# EasyEDA Pro project ne555.eprj

# Schematic NE555BOOT1
Create Date: 2024-05-28; Page Name: P1; Project Name: ne555; Schematic Name: NE555BOOT1; Update Date: 2024-06-29; Company: 嘉立创EDA; Page Size: A4; Version: V1.0
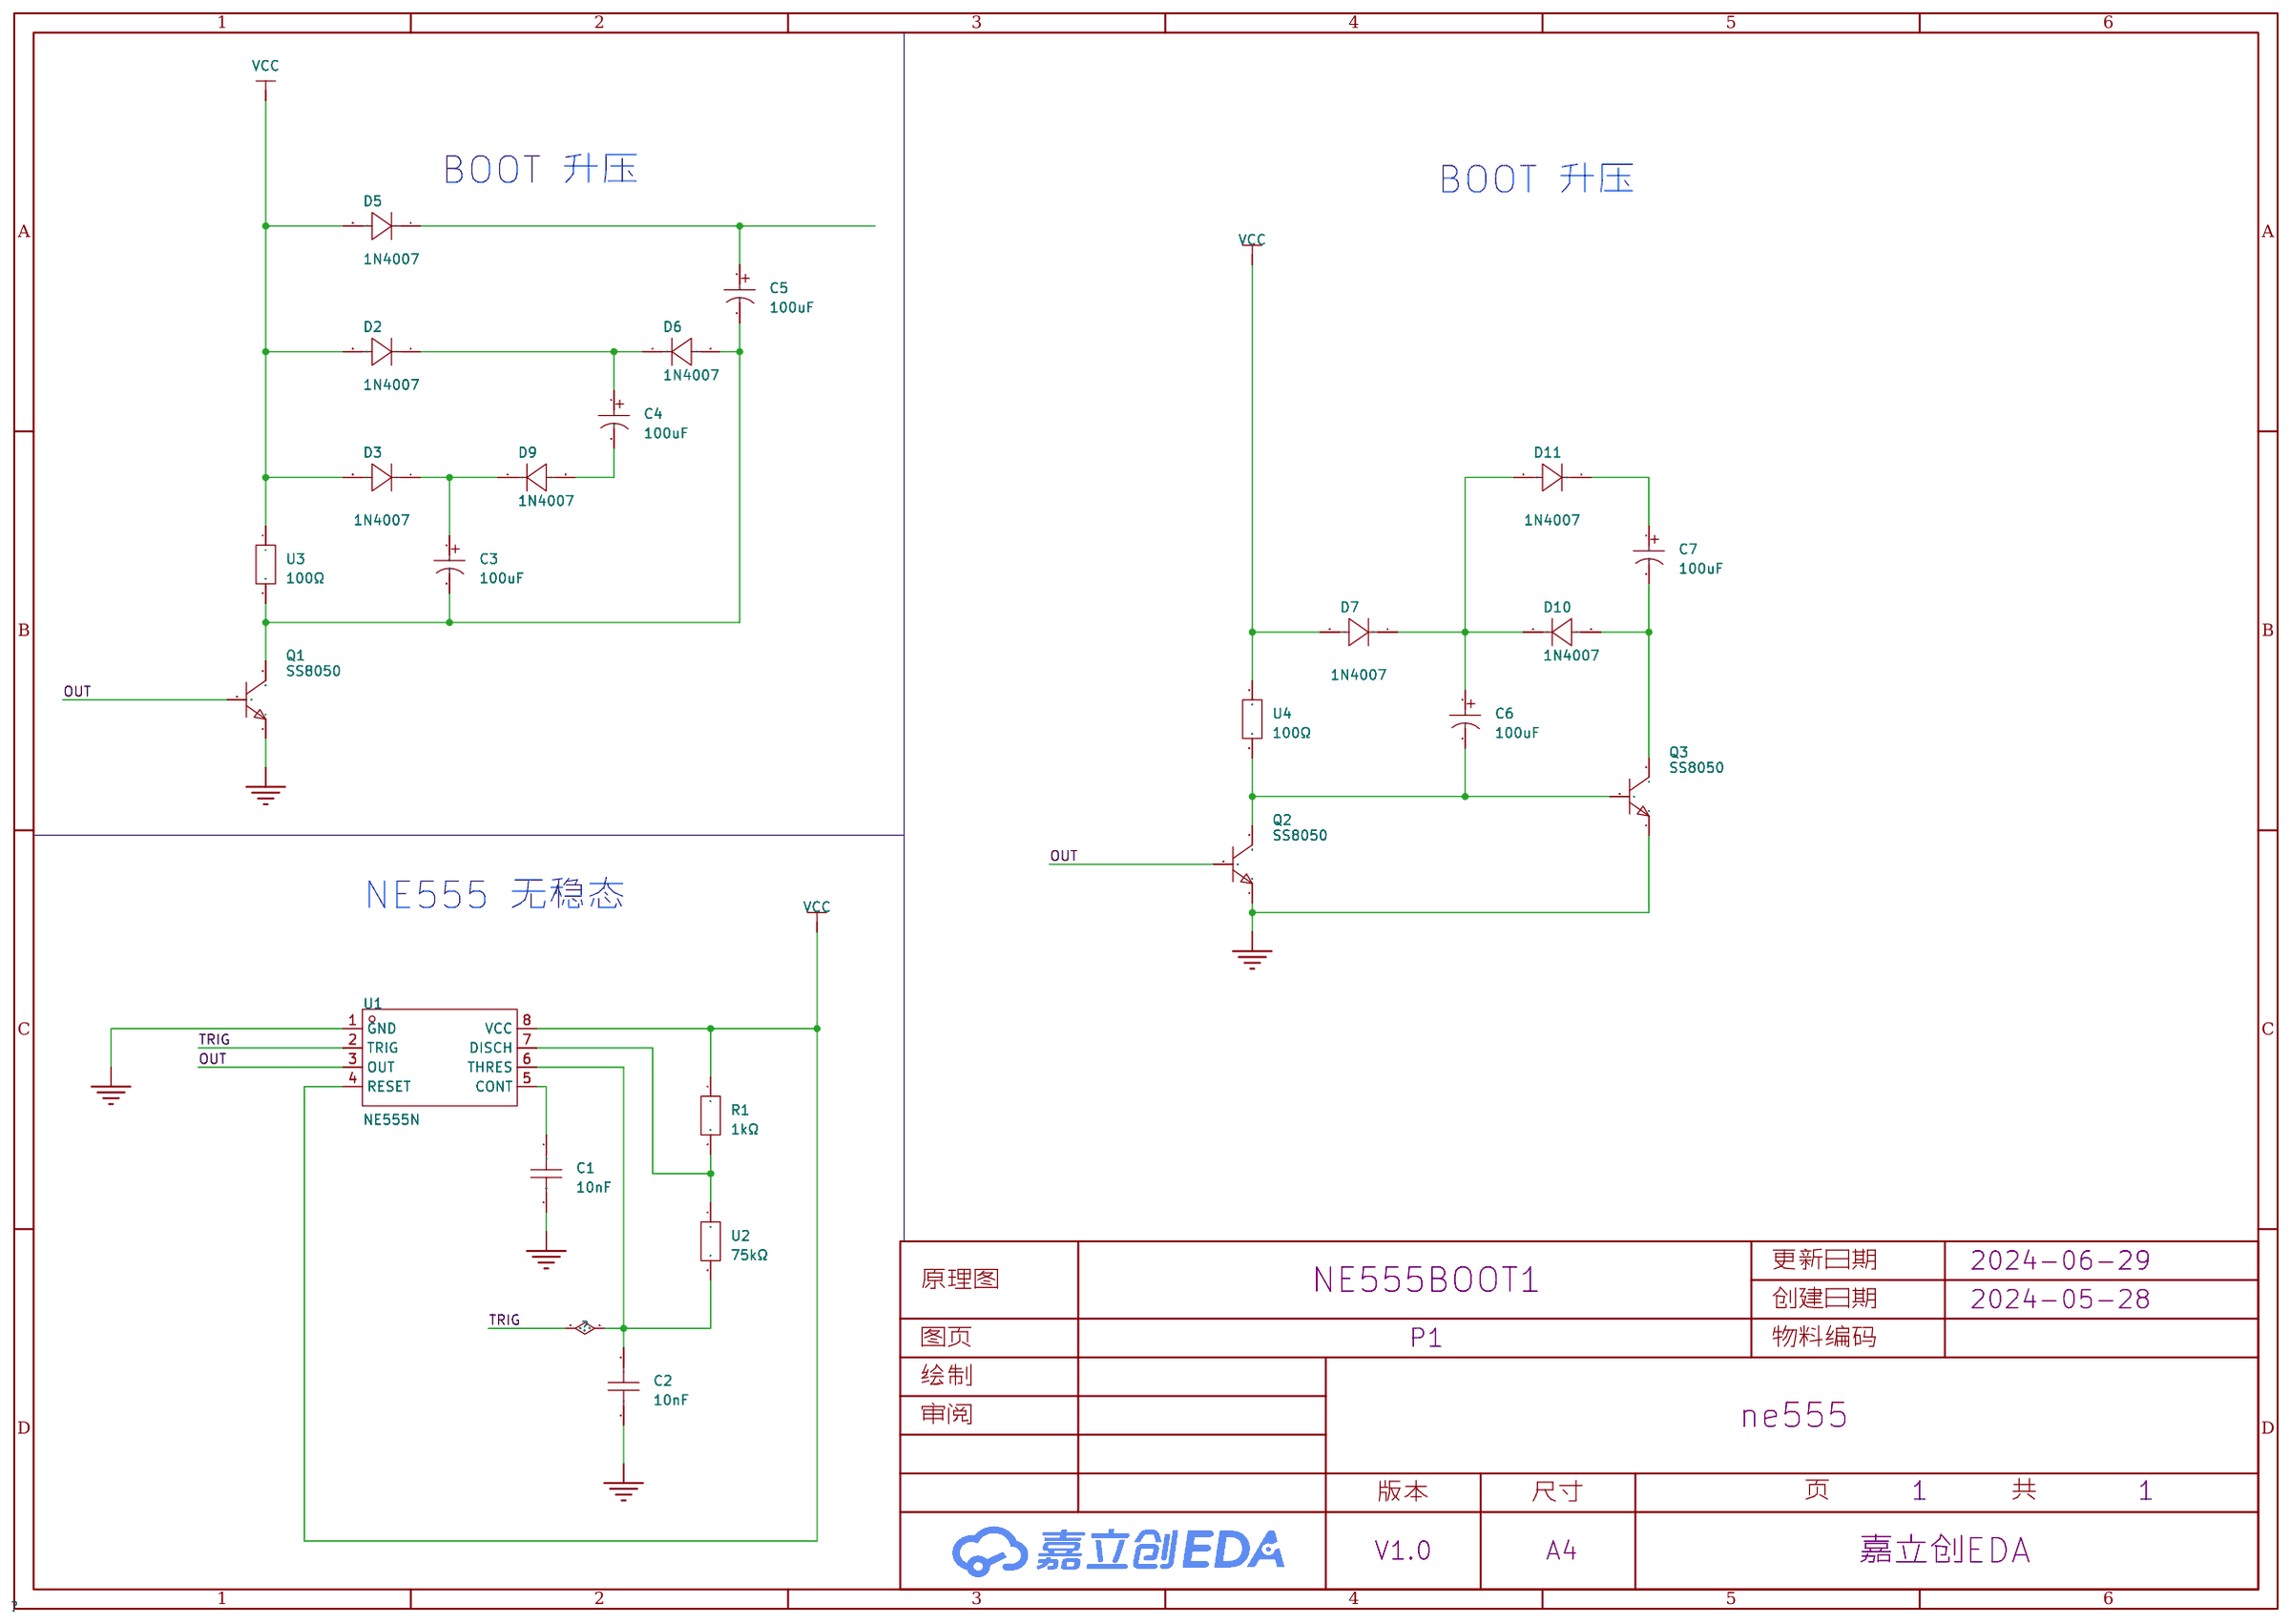
[diagram p0: schematic sheet]

## Parts
C1  10nF  [CAP-TH_L5.0-W3.2-P2.54-D0.6]
C2  10nF  [CAP-TH_L5.0-W3.2-P2.54-D0.6]
C3  100uF  [CAP-TH_BD8.0-P3.50-D0.6-FD]
C4  100uF  [CAP-TH_BD8.0-P3.50-D0.6-FD]
C5  100uF  [CAP-TH_BD8.0-P3.50-D0.6-FD]
C6  100uF  [CAP-TH_BD8.0-P3.50-D0.6-FD]
C7  100uF  [CAP-TH_BD8.0-P3.50-D0.6-FD]
D2  1N4007  [DO-41_BD2.4-L4.7-P8.70-D0.8-RD]
D3  1N4007  [DO-41_BD2.4-L4.7-P8.70-D0.8-RD]
D5  1N4007  [DO-41_BD2.4-L4.7-P8.70-D0.8-RD]
D6  1N4007  [DO-41_BD2.4-L4.7-P8.70-D0.8-RD]
D7  1N4007  [DO-41_BD2.4-L4.7-P8.70-D0.8-RD]
D9  1N4007  [DO-41_BD2.4-L4.7-P8.70-D0.8-RD]
D10  1N4007  [DO-41_BD2.4-L4.7-P8.70-D0.8-RD]
D11  1N4007  [DO-41_BD2.4-L4.7-P8.70-D0.8-RD]
Q1  SS8050  [TO-92-3_L5.1-W4.1-P1.27-L]
Q2  SS8050  [TO-92-3_L5.1-W4.1-P1.27-L]
Q3  SS8050  [TO-92-3_L5.1-W4.1-P1.27-L]
R1  1kΩ  [RES-TH_BD2.7-L6.2-P10.20-D0.4]
U1  NE555N  [DIP-8_L9.8-W6.6-P2.54-LS7.6-BL]
U2  75kΩ  [RES-TH_BD2.3-L3.7-P7.70-D0.9]
U3  100Ω  [RES-TH_BD2.3-L3.7-P7.70-D0.4]
U4  100Ω  [RES-TH_BD2.3-L3.7-P7.70-D0.4]

## Library data of the parts
C1 C2 = CD1H103JA1IECHE100: 容值:10nF;精度:±5%;额定电压:50V;温度系数:NP0;; LCSC Part Name: 10nF ±5% 50V; Supplier Part: C2761737; Manufacturer: Dersonic(德尔创); Supplier Footprint: 插件,P=2.54mm; JLCPCB Part Class: 扩展库; Datasheet: https://atta.szlcsc.com/upload/public/pdf/source/20210512/C2761737_A76C10EC35B7BE95D47A7AA59E9133E2.pdf; Supplier: LCSC; Tolerance: ±5%; Voltage Rated: 50V; Temperature Coefficient: NP0
C3-C7 = 50YXF100MEFC8X11.5: 容值:100uF;精度:±20%;额定电压:50V;; LCSC Part Name: 100uF ±20% 50V; Supplier Part: C88728; Manufacturer: rubycon(红宝石); Supplier Footprint: 插件,D8xL11.5mm; JLCPCB Part Class: 扩展库; Datasheet: https://atta.szlcsc.com/upload/public/pdf/source/20170620/1497944728803.pdf; Supplier: LCSC; Tolerance: ±20%; Rated Voltage: 50V; Lead Spacing: 3.5mm; φD: 8mm; L: 11.5mm; Lifetime @ Temp: 7000hrs@105℃; Operating Temperature: -40℃~+105℃
D2 D3 D5-D7 D9-D11 = 1N4007_C2985028: 正向压降(Vf):1V@1A;直流反向耐压(Vr):1kV;平均整流电流(Io):1A;; LCSC Part Name: 电压:1kV 电流:1A; Supplier Part: C2985028; Manufacturer: GOODWORK(固得沃克); Supplier Footprint: DO-41; JLCPCB Part Class: 扩展库; Datasheet: https://atta.szlcsc.com/upload/public/pdf/source/20210723/C2848669_ECFE0BC1B34B7BAAA686846FF0F306A7.pdf; Supplier: LCSC; Forward Voltage (Vf@If): 1V@1A; Reverse Voltage (Vr): 1kV; Average Rectified Current (Io): 1A
Q1-Q3 = SS8050_C150546: 晶体管类型:NPN;集电极电流(Ic):1.5A;集射极击穿电压(Vceo):25V;功率(Pd):625mW;直流电流增益(hFE@Ic,Vce):160@100mA,1V;; LCSC Part Name: SS8050(RANGE:160-300) D档 160-300; Supplier Part: C150546; Manufacturer: CJ(江苏长电/长晶); Supplier Footprint: TO-92-3; JLCPCB Part Class: 扩展库; Datasheet: https://atta.szlcsc.com/upload/public/pdf/source/20180122/C150546_15166125460571291137.pdf; Supplier: LCSC; Transistor Type: NPN; Collector Current (Ic): 1.5A; Collector-Emitter Breakdown Voltage (Vceo): 25V; Power Dissipation (Pd): 625mW; DC Current Gain (hFE@Ic,Vce): 160@100mA,1V; Transition Frequency (fT): 100MHz; Collector Cut-Off Current (Icbo): 100nA; Collector-Emitter Saturation Voltage (VCE(sat)@Ic,Ib): 500mV@800mA,80mA
R1 = MF1/4W-1K±1%-ST52: 电阻类型:金属膜电阻;阻值:1kΩ;精度:±1%;功率:250mW;温度系数:±100ppm/℃;; LCSC Part Name: 金属膜电阻 1kΩ ±1% 250mW; Supplier Part: C2903245; Manufacturer: VO(翔胜); Supplier Footprint: 插件,D2.7xL6.2mm; JLCPCB Part Class: 扩展库; Datasheet: https://atta.szlcsc.com/upload/public/pdf/source/20200609/C601728_5AA4C0C8E12E11069DA2C3356F29D1F2.pdf; Supplier: LCSC; Type: 金属膜电阻; Tolerance: ±1%; Overload Voltage (Max): 250V; Power(Watts): 250mW; Temperature Coefficient: ±100ppm/℃; Operating Temperature Range: -55℃~+155℃
U1 = NE555N_C398063: LCSC Part Name: 时基集成芯片; Supplier Part: C398063; Manufacturer: HGSEMI(华冠); Supplier Footprint: DIP-8; JLCPCB Part Class: 扩展库; Datasheet: https://atta.szlcsc.com/upload/public/pdf/source/20210507/C398063_2BAEB56D23EF029756B1D4DE6D68B235.pdf; Supplier: LCSC
U2 = MF1/8W-75K±1%-ST26: 电阻类型:金属膜电阻;阻值:75kΩ;精度:±1%;功率:125mW;温度系数:±100ppm/℃;; LCSC Part Name: 金属膜电阻 75kΩ ±1% 125mW; Supplier Part: C2903373; Manufacturer: VO(翔胜); Supplier Footprint: 插件,D2.3xL3.7mm; JLCPCB Part Class: 扩展库; Datasheet: https://atta.szlcsc.com/upload/public/pdf/source/20200609/C601728_5AA4C0C8E12E11069DA2C3356F29D1F2.pdf; Supplier: LCSC; Type: 金属膜电阻; Tolerance: ±1%; Overload Voltage (Max): 200V; Power(Watts): 125mW; Temperature Coefficient: ±100ppm/℃; Operating Temperature Range: -55℃~+155℃
U3 U4 = MF1/8W-100Ω±1%-ST52: 电阻类型:金属膜电阻;阻值:100Ω;精度:±1%;功率:125mW;温度系数:±100ppm/℃;; LCSC Part Name: 金属膜电阻 100Ω ±1% 125mW; Supplier Part: C2903312; Manufacturer: VO(翔胜); Supplier Footprint: 插件,D2.3xL3.7mm; JLCPCB Part Class: 扩展库; Datasheet: https://atta.szlcsc.com/upload/public/pdf/source/20200609/C601728_5AA4C0C8E12E11069DA2C3356F29D1F2.pdf; Supplier: LCSC; Type: 金属膜电阻; Tolerance: ±1%; Overload Voltage (Max): 200V; Power(Watts): 125mW; Temperature Coefficient: ±100ppm/℃; Operating Temperature Range: -55℃~+155℃

## Nets
GND: C1.2 C2.2 Q1.1(E) Q2.1(E) Q3.1(E) U1.1(GND)
VCC: D2.2(A) D3.2(A) D5.2(A) D7.2(A) R1.1 U1.4(RESET) U1.8(VCC) U3.1 U4.1
OUT: Q1.2(B) Q2.2(B) U1.3(OUT)
TRIG: C2.1 U1.2(TRIG) U1.6(THRES) U2.2
Net-(C1-1): C1.1 U1.5(CONT)
Net-(C3-1): C3.1 D3.1(K) D9.1(K)
Net-(C3-2): C3.2 C5.2 D6.2(A) Q1.3(C) U3.2
Net-(C4-1): C4.1 D2.1(K) D6.1(K)
Net-(C4-2): C4.2 D9.2(A)
Net-(C5-1): C5.1 D5.1(K)
Net-(C6-1): C6.1 D7.1(K) D10.1(K) D11.2(A)
Net-(C6-2): C6.2 Q2.3(C) Q3.2(B) U4.2
Net-(C7-1): C7.1 D11.1(K)
Net-(C7-2): C7.2 D10.2(A) Q3.3(C)
Net-(R1-2): R1.2 U1.7(DISCH) U2.1

## Notes on the sheet
- BOOT 升压
- BOOT 升压
- NE555 无稳态

# Schematic NE555SWITCH1
Create Date: 2024-06-28; Page Name: P1; Project Name: ne555; Schematic Name: Schematic1; Update Date: 2024-06-29; Company: 嘉立创EDA; Page Size: A4; Version: V1.0
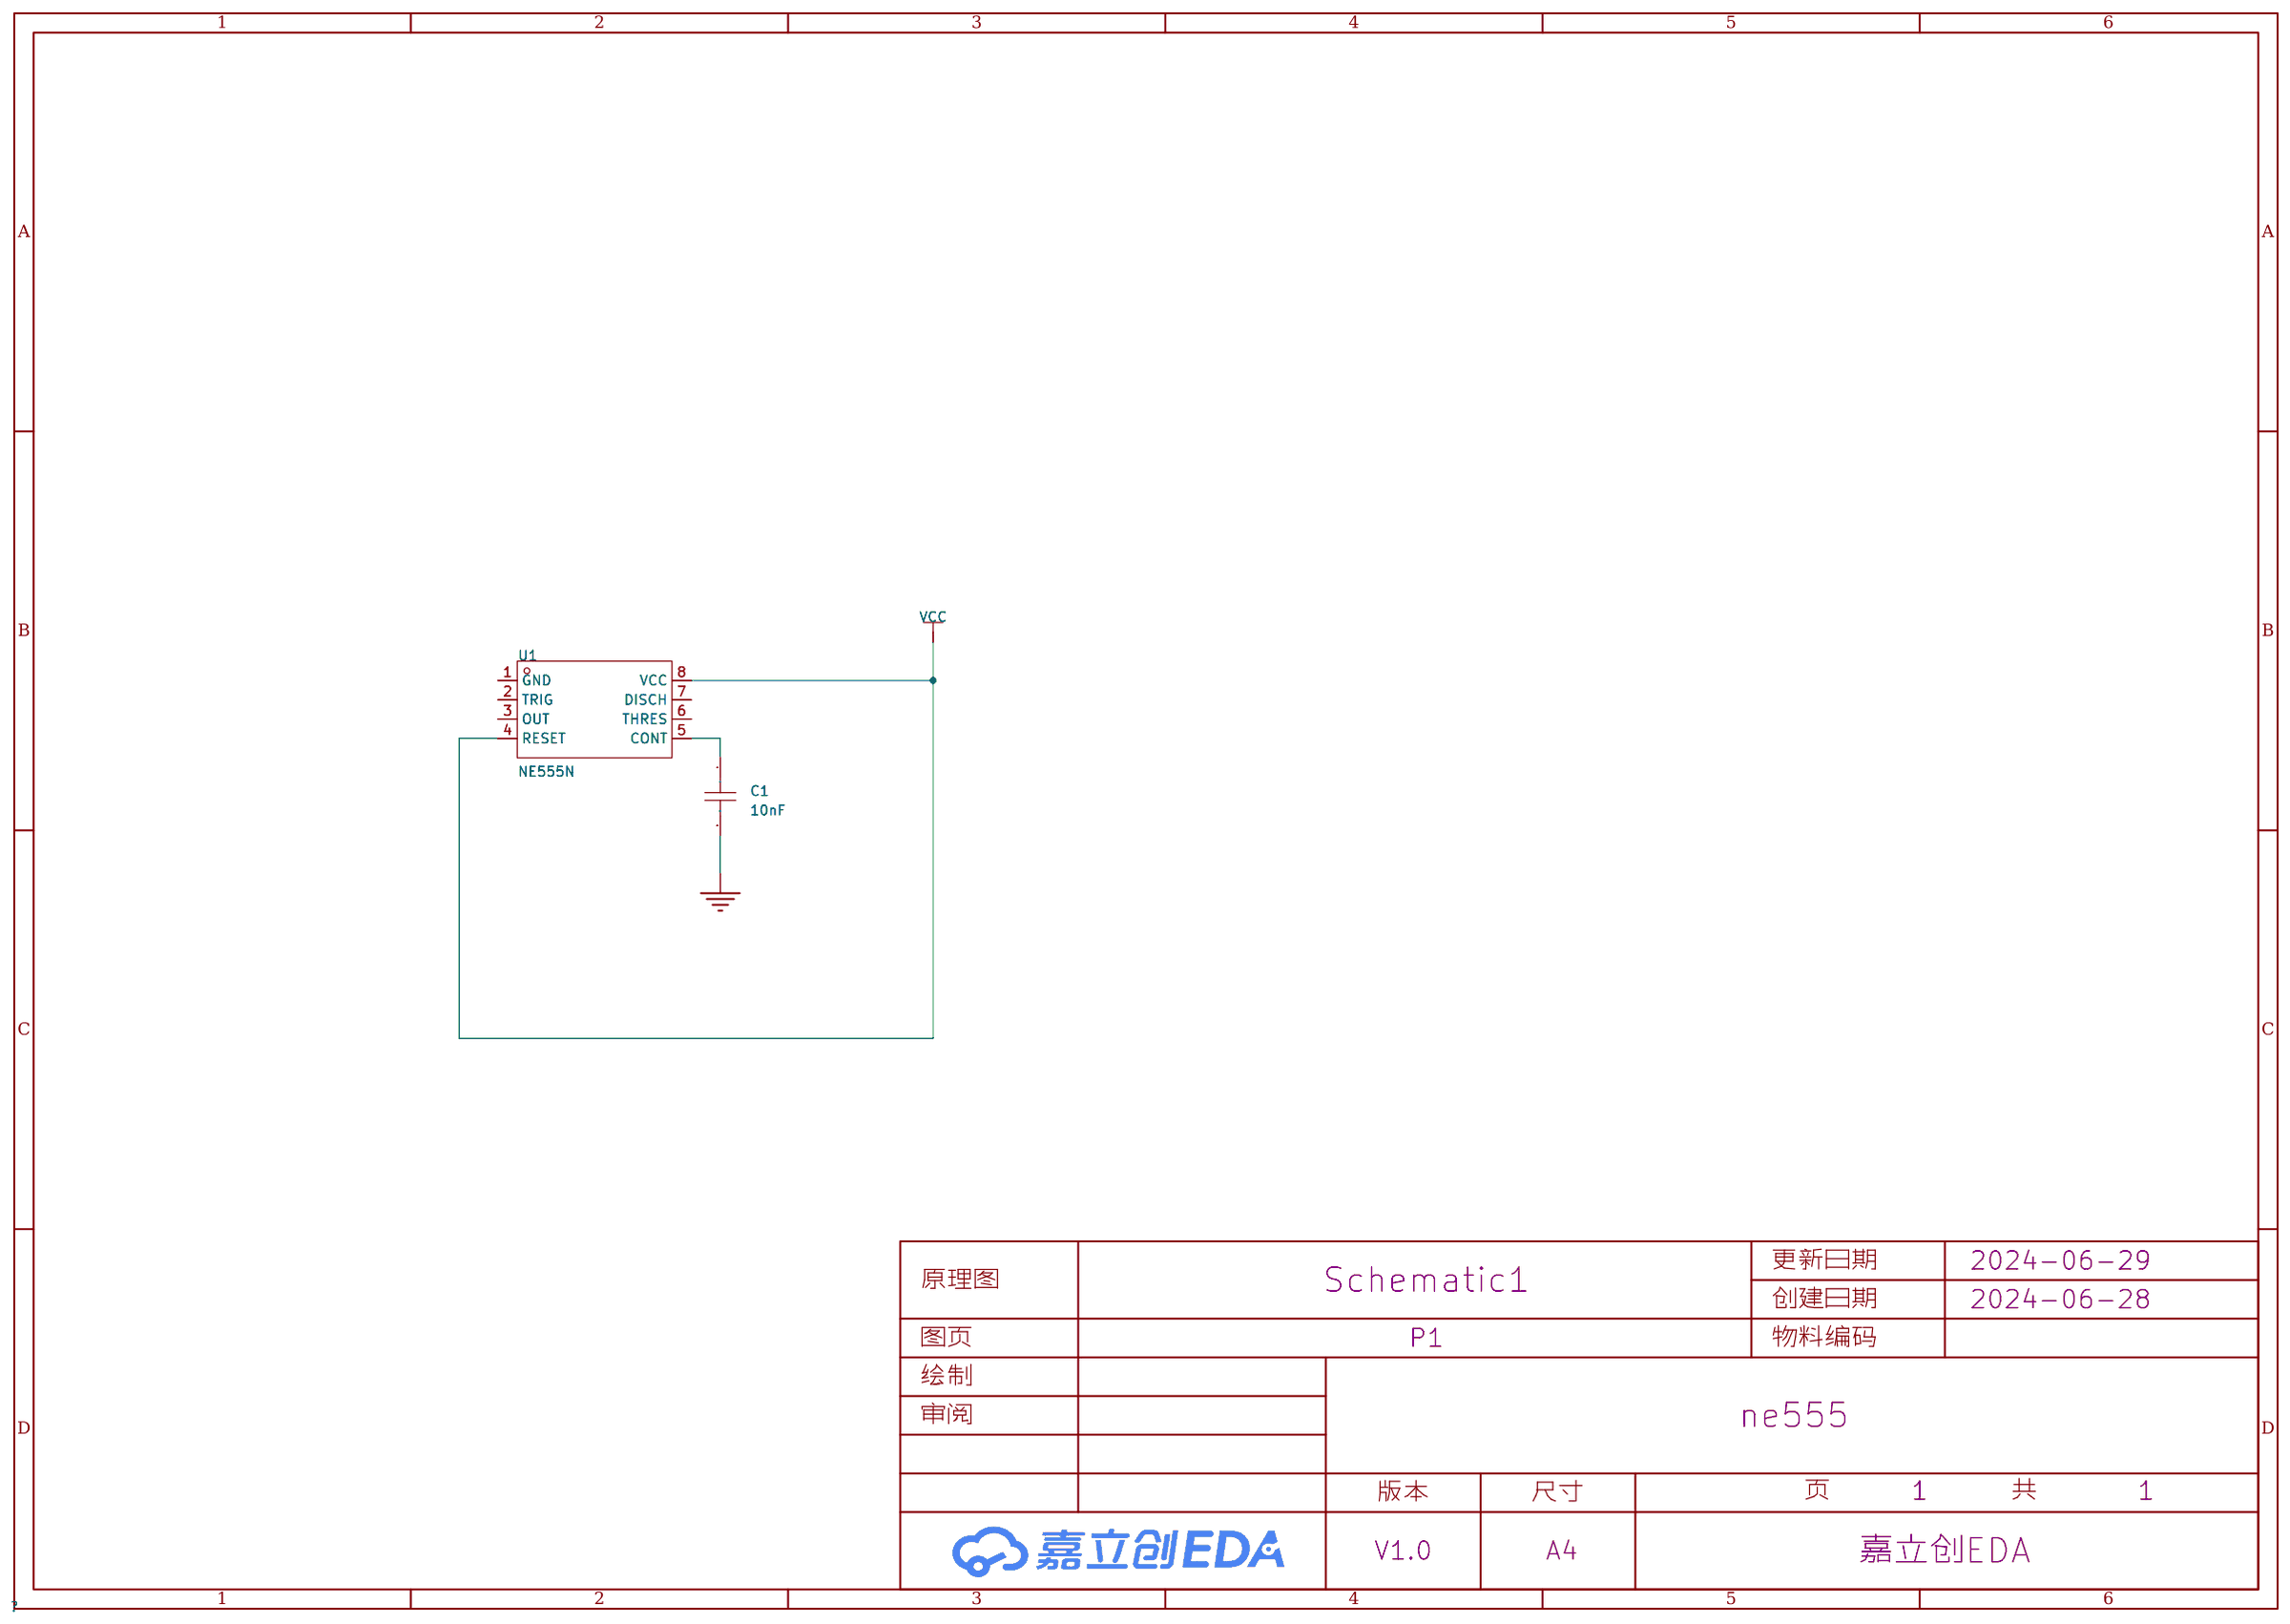
[diagram p1: schematic sheet]

## Parts
C1  10nF  [CAP-TH_L5.0-W3.2-P2.54-D0.6]
U1  NE555N  [DIP-8_L9.8-W6.6-P2.54-LS7.6-BL]

## Library data of the parts
C1 = CD1H103JA1IECHE100: 容值:10nF;精度:±5%;额定电压:50V;温度系数:NP0;; LCSC Part Name: 10nF ±5% 50V; Supplier Part: C2761737; Manufacturer: Dersonic(德尔创); Supplier Footprint: 插件,P=2.54mm; JLCPCB Part Class: 扩展库; Datasheet: https://atta.szlcsc.com/upload/public/pdf/source/20210512/C2761737_A76C10EC35B7BE95D47A7AA59E9133E2.pdf; Supplier: LCSC; Tolerance: ±5%; Voltage Rated: 50V; Temperature Coefficient: NP0
U1 = NE555N_C398063: LCSC Part Name: 时基集成芯片; Supplier Part: C398063; Manufacturer: HGSEMI(华冠); Supplier Footprint: DIP-8; JLCPCB Part Class: 扩展库; Datasheet: https://atta.szlcsc.com/upload/public/pdf/source/20210507/C398063_2BAEB56D23EF029756B1D4DE6D68B235.pdf; Supplier: LCSC

## Nets
GND: C1.2
VCC: U1.4(RESET) U1.8(VCC)
Net-(C1-1): C1.1 U1.5(CONT)

Not connected (* = marked no-connect by the designer): U1 1(GND) 2(TRIG) 3(OUT) 6(THRES) 7(DISCH)
